# Altium schematic sheet LAN8720A-CP-TR1_LAN8720A-CP-TR.schdoc
size 127 x 101 mm
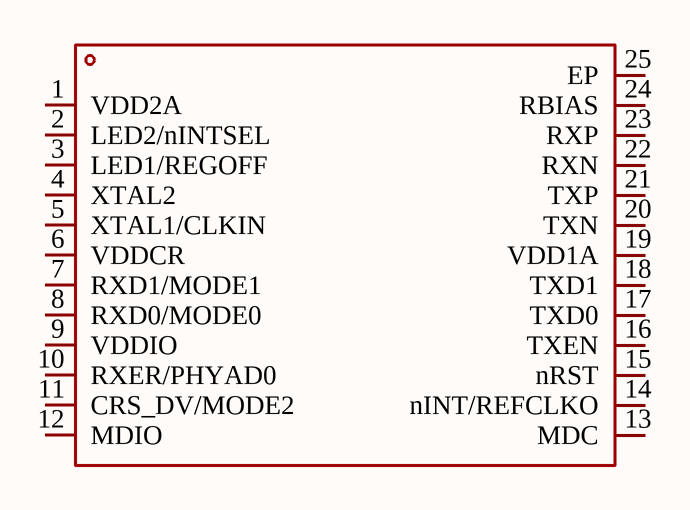
[diagram p0: LAN8720A-CP-TR1_LAN8720A-CP-TR.schdoc]

## Parts
U?  LAN8720A-CP-TR  [QFN-24_L4.0-W4.0-P0.50-BL-EP2.6]  (value not drawn)

## Nets

Not connected (* = marked no-connect by the designer): U? 1(VDD2A) 2(LED2/nINTSEL) 3(LED1/REGOFF) 4(XTAL2) 5(XTAL1/CLKIN) 6(VDDCR) 7(RXD1/MODE1) 8(RXD0/MODE0) 9(VDDIO) 10(RXER/PHYAD0) 11(CRS_DV/MODE2) 12(MDIO) 13(MDC) 14(nINT/REFCLKO) 15(nRST) 16(TXEN) 17(TXD0) 18(TXD1) 19(VDD1A) 20(TXN) 21(TXP) 22(RXN) 23(RXP) 24(RBIAS) 25(EP)

## Library data of the parts
U? = LAN8720A-CP-TR: Manufacturer: MICROCHIP(美国微芯); Add into BOM: yes; Applications Function: PHY收发器; Interface: RMII; Voltage - Supply: 1.6V~3.6V; Symbol: LAN8720A-CP-TR; Device: LAN8720A-CP-TR; LCSC Part Name: 小型RMIl 10/100以太网收发器，支持HP Auto-MDIX; Supplier Part: C45223; Manufacturer Part: LAN8720A-CP-TR; Supplier Footprint: QFN-24-EP(4x4); JLCPCB Part Class: Extended Part; Datasheet: https://item.szlcsc.com/datasheet/LAN8720A-CP-TR/46225.html; Supplier: LCSC; Convert to PCB: yes; Number of Channels: -; Operating Temperature: 0℃~+85℃